# Altium project NEW2018brush_driver_PCB_Project.PrjPcb
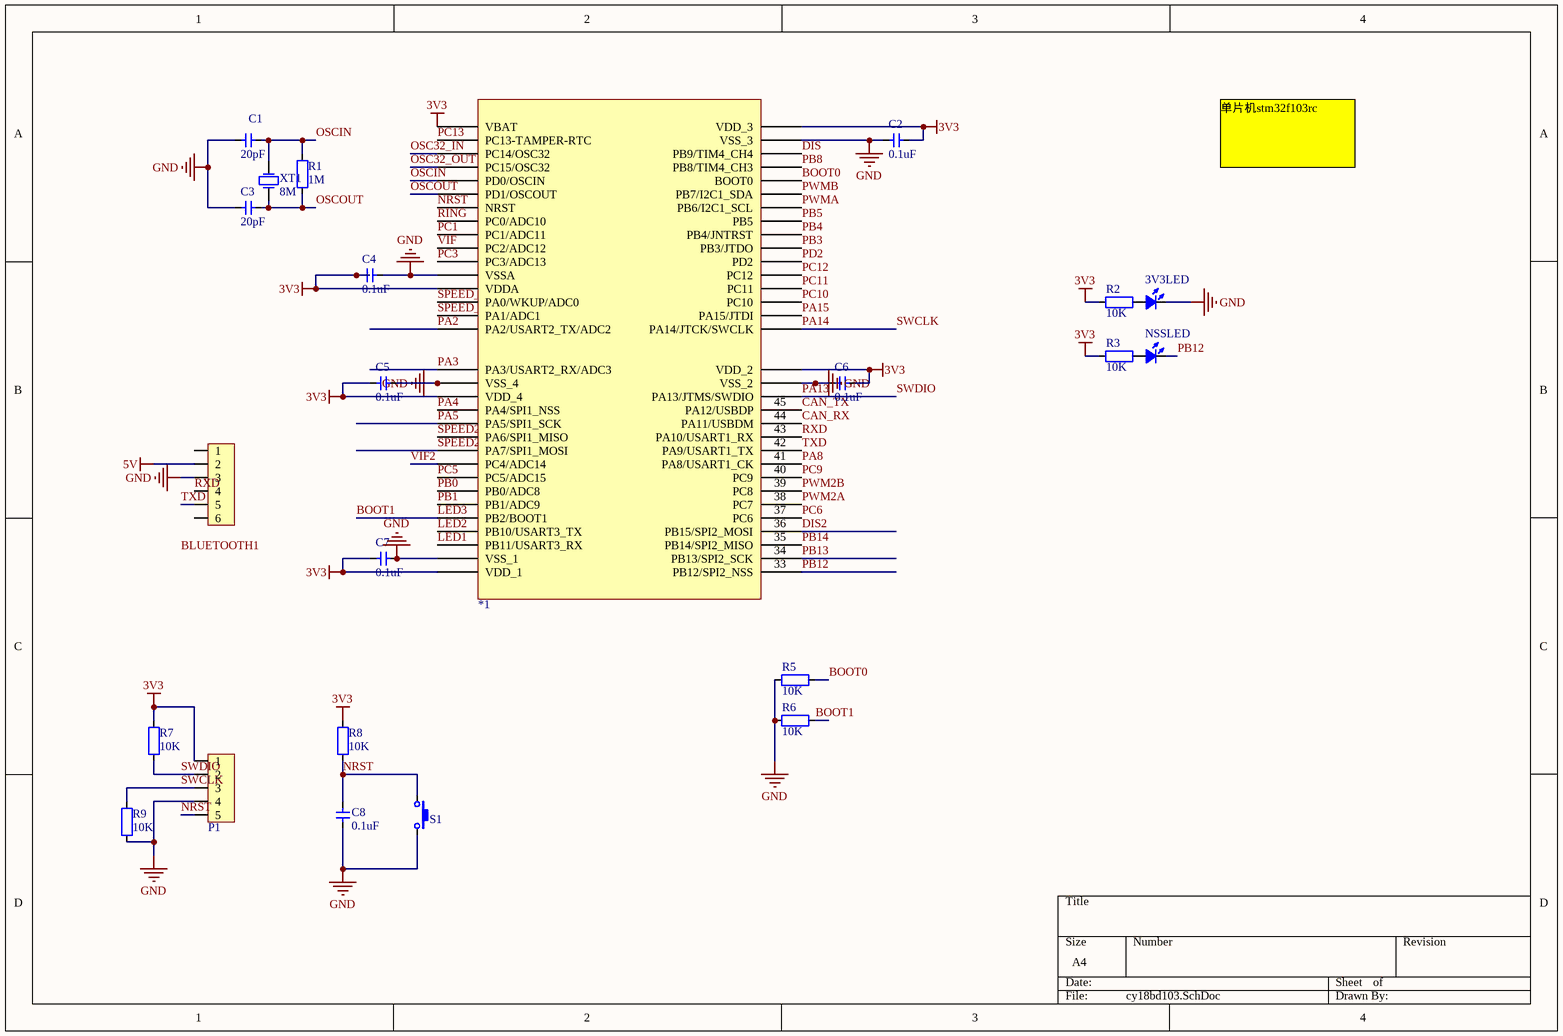
[diagram p0: cy18bd103.SchDoc]
9 sheets, 93 parts. Net scope: global (net labels, ports and power ports of the same name join across sheets).
Board file: cybd18V1.2.3F.PcbDoc
Sheets:
  cy18bd103.SchDoc
  HIP4082driver.SchDoc
  taj1050.SchDoc
  lm27313_5_12.SchDoc
  hcpl0630.SchDoc
  tps5430_VIN_5V.SchDoc
  tlv117_5_3.3.SchDoc
  74ls08.SchDoc
  电流环.SchDoc

## Sheet cy18bd103.SchDoc
size A4

### Parts
3V3LED  LED_0805blue  [LED_0805_YELLOW]  (value not drawn)
*1  STM32F103RC  [LQFP_P0.5_64]  (value not drawn)
BLUETOOTH1  HDR1x6_2.54  [HDR1X6_2.54_180]  (value not drawn)
C1  value 20pF  [CAP_0603]  (hidden comment: Cap_0603)
C2  value 0.1uF  [CAP_0603]  (hidden comment: Cap_0603)
C3  value 20pF  [CAP_0603]  (hidden comment: Cap_0603)
C4  value 0.1uF  [CAP_0603]  (hidden comment: Cap_0603)
C5  value 0.1uF  [CAP_0603]  (hidden comment: Cap_0603)
C6  value 0.1uF  [CAP_0603]  (hidden comment: Cap_0603)
C7  value 0.1uF  [CAP_0603]  (hidden comment: Cap_0603)
C8  value 0.1uF  [CAP_0603]  (hidden comment: Cap_0603)
NSSLED  LED_0805green  [LED_0805_GREEN]  (value not drawn)
P1  HDR1x5_2.54  [HDR1X5_2.54_180]  (value not drawn)
R1  value 1M  [RES_0603]  (hidden comment: Res_0603)
R2  value 10K  [RES_0603]  (hidden comment: Res_0603)
R3  value 10K  [RES_0603]  (hidden comment: Res_0603)
R5  value 10K  [RES_0603]  (hidden comment: Res_0603)
R6  value 10K  [RES_0603]  (hidden comment: Res_0603)
R7  value 10K  [RES_0603]  (hidden comment: Res_0603)
R8  value 10K  [RES_0603]  (hidden comment: Res_0603)
R9  value 10K  [RES_0603]  (hidden comment: Res_0603)
S1  ButtonTACT_3x6x2.5_180  [ButtonTACT_3x6x2.5_180]  (value not drawn)
XT1  value 8M  [XT_5032_2]  (hidden comment: XTAL_32.768kHz)

### Nets
3V3: *1.1(VBAT) *1.13(VDDA) *1.19(VDD_4) *1.32(VDD_1) *1.48(VDD_2) *1.64(VDD_3) C2.2 C4.1 C5.1 C6.2 C7.1 P1.1 R2.1 R3.1 R7.2 R8.2
5V: BLUETOOTH1.2
GND: 3V3LED.2(K) *1.12(VSSA) *1.18(VSS_4) *1.31(VSS_1) *1.47(VSS_2) *1.63(VSS_3) BLUETOOTH1.3 C1.1 C2.1 C3.1 C4.2 C5.2 C6.1 C7.2 C8.1 P1.4 R5.2 R6.2 R9.1 S1.2
BOOT0: *1.60(BOOT0) R5.1
BOOT1: *1.28(PB2/BOOT1) R6.1  [also labelled LED3]
CAN_RX: *1.44(PA11/USBDM)
CAN_TX: *1.45(PA12/USBDP)
DIS: *1.62(PB9/TIM4_CH4)
DIS2: *1.36(PB15/SPI2_MOSI)
LED1: *1.30(PB11/USART3_RX)
LED2: *1.29(PB10/USART3_TX)
NRST: *1.7(NRST) C8.2 P1.5 R8.1 S1.1
OSC32_IN: *1.3(PC14/OSC32)
OSC32_OUT: *1.4(PC15/OSC32)
OSCIN: *1.5(PD0/OSCIN) C1.2 R1.2 XT1.2(OSC2)
OSCOUT: *1.6(PD1/OSCOUT) C3.2 R1.1 XT1.1(OSC1)
PA2: *1.16(PA2/USART2_TX/ADC2)
PA3: *1.17(PA3/USART2_RX/ADC3)
PA4: *1.20(PA4/SPI1_NSS)
PA5: *1.21(PA5/SPI1_SCK)
PA8: *1.41(PA8/USART1_CK)
PA13: *1.46(PA13/JTMS/SWDIO) P1.2 R7.1  [also labelled SWDIO]
PA14: *1.49(PA14/JTCK/SWCLK) P1.3 R9.2  [also labelled SWCLK]
PA15: *1.50(PA15/JTDI)
PB0: *1.26(PB0/ADC8)
PB1: *1.27(PB1/ADC9)
PB3: *1.55(PB3/JTDO)
PB4: *1.56(PB4/JNTRST)
PB5: *1.57(PB5)
PB8: *1.61(PB8/TIM4_CH3)
PB12: *1.33(PB12/SPI2_NSS) NSSLED.2(K)
PB13: *1.34(PB13/SPI2_SCK)
PB14: *1.35(PB14/SPI2_MISO)
PC1: *1.9(PC1/ADC11)
PC3: *1.11(PC3/ADC13)
PC5: *1.25(PC5/ADC15)
PC6: *1.37(PC6)
PC9: *1.40(PC9)
PC10: *1.51(PC10)
PC11: *1.52(PC11)
PC12: *1.53(PC12)
PC13: *1.2(PC13-TAMPER-RTC)
PD2: *1.54(PD2)
PWM2A: *1.38(PC7)
PWM2B: *1.39(PC8)
PWMA: *1.58(PB6/I2C1_SCL)
PWMB: *1.59(PB7/I2C1_SDA)
RING: *1.8(PC0/ADC10)
RXD: *1.43(PA10/USART1_RX) BLUETOOTH1.4
SPEED2_A: *1.22(PA6/SPI1_MISO)
SPEED2_B: *1.23(PA7/SPI1_MOSI)
SPEED_A: *1.14(PA0/WKUP/ADC0)
SPEED_B: *1.15(PA1/ADC1)
TXD: *1.42(PA9/USART1_TX) BLUETOOTH1.5
VIF: *1.10(PC2/ADC12)
VIF2: *1.24(PC4/ADC14)
Net3V3LED_1: 3V3LED.1(A) R2.2
NetNSSLED_1: NSSLED.1(A) R3.2

Not connected (* = marked no-connect by the designer): BLUETOOTH1 1 6

### Notes on the sheet
- 单片机stm32f103rc

### Library data of the parts
3V3LED NSSLED = LED_0805: LED
*1 = STM32F103RC: MCU
BLUETOOTH1 = HDR1x6_2.54: Header
C1-C8 = Cap_0603: Capacitor
P1 = HDR1x5_2.54: Header
R1-R3 R5-R9 = Res_0603: Resistor
S1 = ButtonTACT_3x6x2.5_180: Button
XT1 = XTAL_32.768k: Crystal Oscillator

## Sheet HIP4082driver.SchDoc
size A4
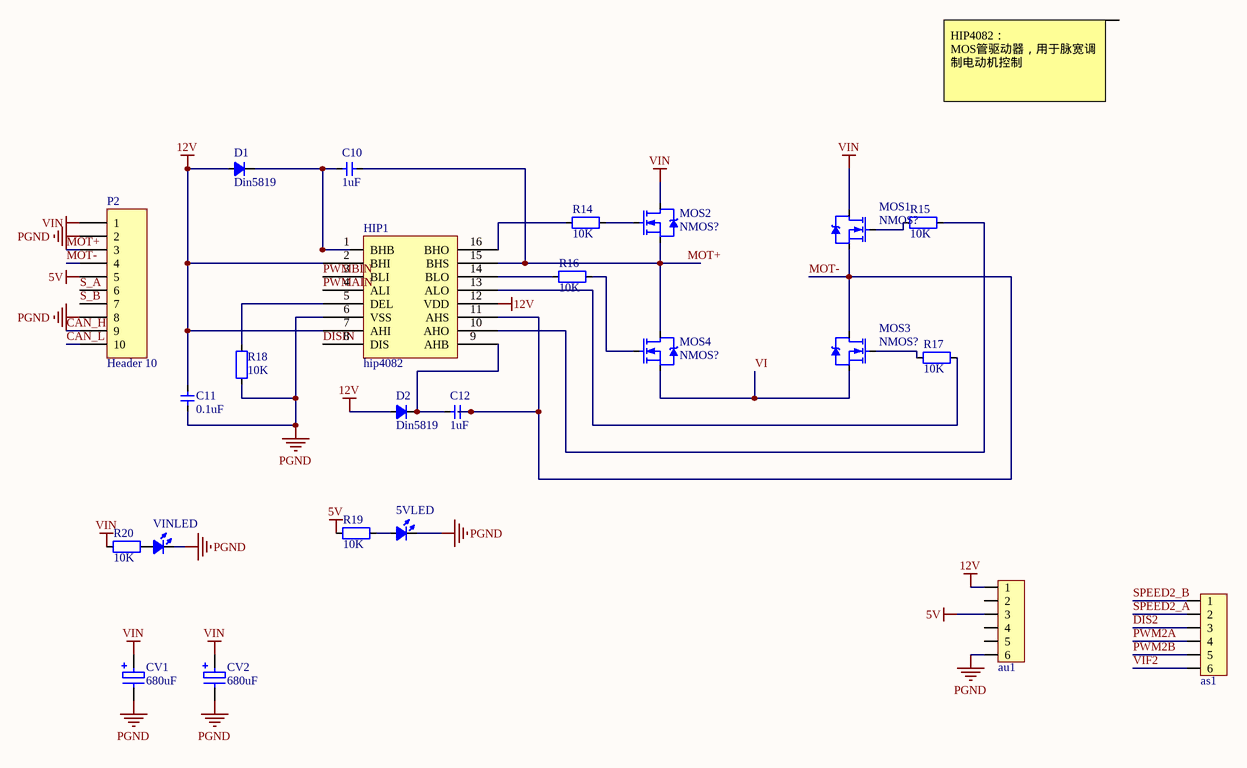
[diagram p1: HIP4082driver.SchDoc]

### Parts
5VLED  LED_0805  [LED_0805_BLUE]  (value not drawn)
as1  HDR1x6_2.54  [HDR1X6_2.54_180]  (value not drawn)
au1  HDR1x6_2.54  [HDR1X6_2.54_180]  (value not drawn)
C10  value 1uF  [CAP_0603]  (hidden comment: Cap_0603)
C11  value 0.1uF  [CAP_0603]  (hidden comment: Cap_0603)
C12  value 1uF  [CAP_0603]  (hidden comment: Cap_0603)
CV1  680uF  [CAP_ELE_680UF0.7X5MM]
CV2  680uF  [CAP_ELE_680UF0.7X5MM]
D1  Din5819  [SOD-323]
D2  Din5819  [SOD-323]
HIP1  hip4082  [SOP_E150_16]
MOS1  value NMOS?  [TO-252AA]  (hidden comment: MOSFET_N)
MOS2  value NMOS?  [TO-252AA]  (hidden comment: MOSFET_N)
MOS3  value NMOS?  [TO-252AA]  (hidden comment: MOSFET_N)
MOS4  value NMOS?  [TO-252AA]  (hidden comment: MOSFET_N)
P2  Header 10  [Green_10P]
R14  value 10K  [RES_0603]  (hidden comment: Res_0603)
R15  value 10K  [RES_0603]  (hidden comment: Res_0603)
R16  value 10K  [RES_0603]  (hidden comment: Res_0603)
R17  value 10K  [RES_0603]  (hidden comment: Res_0603)
R18  value 10K  [RES_0603]  (hidden comment: Res_0603)
R19  value 10K  [RES_0603]  (hidden comment: Res_0603)
R20  value 10K  [RES_0603]  (hidden comment: Res_0603)
VINLED  LED_0805  [LED_0805_RED]  (value not drawn)

### Nets
5V: au1.3 P2.5 R19.1
12V: au1.1 C11.2 D1.1(A) D2.1(A) HIP1.2(BHI) HIP1.7(AHI) HIP1.12(VDD)
PGND: 5VLED.2(K) au1.6 C11.1 CV1.2 CV2.2 HIP1.6(VSS) P2.2 P2.8 R18.1 VINLED.2(K)
VIN: CV1.1 CV2.1 MOS1.4(D) MOS2.4(D) P2.1 R20.1
CAN_H: P2.9
CAN_L: P2.10
DIS2: as1.3
DISIN: HIP1.8(DIS)
MOT+: C10.2 HIP1.15(BHS) MOS2.3(S) MOS4.4(D) P2.3
MOT-: C12.2 HIP1.11(AHS) MOS1.3(S) MOS3.4(D) P2.4
PWM2A: as1.4
PWM2B: as1.5
PWMAIN: HIP1.4(ALI)
PWMBIN: HIP1.3(BLI)
S_A: P2.6
S_B: P2.7
SPEED2_A: as1.2
SPEED2_B: as1.1
VI: MOS3.3(S) MOS4.3(S)
VIF2: as1.6
Net5VLED_1: 5VLED.1(A) R19.2
NetC10_1: C10.1 D1.2(K) HIP1.1(BHB)
NetC12_1: C12.1 D2.2(K) HIP1.9(AHB)
NetHIP1_5: HIP1.5(DEL) R18.2
NetHIP1_10: HIP1.10(AHO) R15.2
NetHIP1_13: HIP1.13(ALO) R17.2
NetHIP1_14: HIP1.14(BLO) R16.1
NetHIP1_16: HIP1.16(BHO) R14.1
NetMOS1_1: MOS1.1(G) R15.1
NetMOS2_1: MOS2.1(G) R14.2
NetMOS3_1: MOS3.1(G) R17.1
NetMOS4_1: MOS4.1(G) R16.2
NetR20_2: R20.2 VINLED.1(A)

Not connected (* = marked no-connect by the designer): au1 2 4 5

### Notes on the sheet
- HIP4082：
  MOS管驱动器，用于脉宽调制电动机控制

### Library data of the parts
5VLED VINLED = LED_0603: LED
as1 au1 = HDR1x6_2.54: Header
C10-C12 = Cap_0603: Capacitor
CV1 CV2 = CAP-ELE: 电解电容; Value: *μF; Published: 8-Jun-2000; LatestRevisionDate: 17-Jul-2002; LatestRevisionNote: Re-released for DXP Platform.; PackageReference: RB7.6-15; Publisher: Altium Limited; PackageDescription: Polarized Capacitor (Radial); 2 Leads
D1 D2 = Diode
MOS1-MOS4 = MOSFET_N: MOSFET
P2 = Header 10: Header, 10-Pin; LatestRevisionDate: 17-Jul-2002; LatestRevisionNote: Re-released for DXP Platform.; Publisher: Altium Limited
R14-R20 = Res_0603: Resistor

## Sheet taj1050.SchDoc
size A4
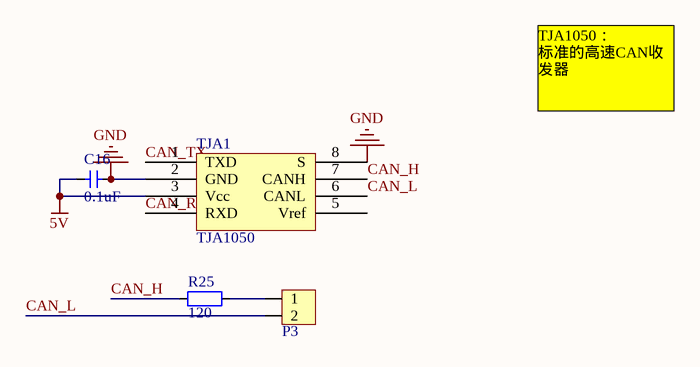
[diagram p2: taj1050.SchDoc]

### Parts
C16  value 0.1uF  [CAP_0603]  (hidden comment: Cap_0603)
P3  HDR1x2_2.54  [HDR1X2_2.54_180]  (value not drawn)
R25  value 120  [RES_0603]  (hidden comment: Res_0603)
TJA1  TJA1050  [SOP_E150_8]

### Nets
5V: C16.1 TJA1.3(Vcc)
GND: C16.2 TJA1.2(GND) TJA1.8(S)
CAN_H: R25.1 TJA1.7(CANH)
CAN_L: P3.2 TJA1.6(CANL)
CAN_RX: TJA1.4(RXD)
CAN_TX: TJA1.1(TXD)
NetP3_1: P3.1 R25.2

Not connected (* = marked no-connect by the designer): TJA1 5(Vref)

### Notes on the sheet
- TJA1050：
  标准的高速CAN收发器

### Library data of the parts
C16 = Cap_0603: Capacitor
P3 = HDR1x2_2.54: Header
R25 = Res_0603: Resistor
TJA1 = TJA1050: CAN总线收发器

## Sheet lm27313_5_12.SchDoc
size A4
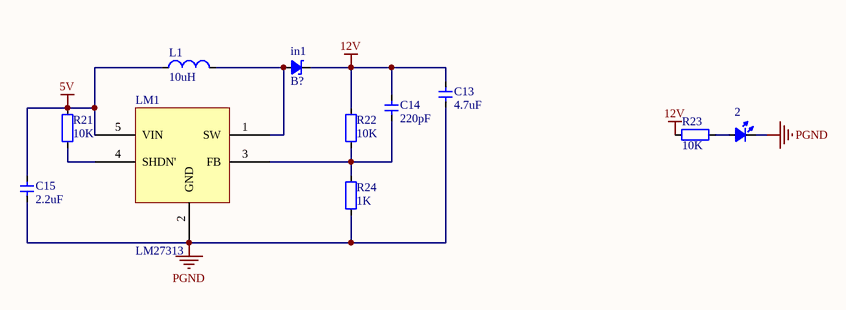
[diagram p3: lm27313_5_12.SchDoc]

### Parts
2  LED_0805  [LED_0805_GREEN]  (value not drawn)
C13  value 4.7uF  [CAP_0603]  (hidden comment: Cap_0603)
C14  value 220pF  [CAP_0603]  (hidden comment: Cap_0603)
C15  value 2.2uF  [CAP_0603]  (hidden comment: Cap_0603)
in1  value B?  [SOD-123]  (hidden comment: SchottkyDiode_SOD123)
L1  value 10uH  [indmm5x2_2_2]
LM1  LM27313  [SOT23-5]
R21  value 10K  [RES_0603]  (hidden comment: Res_0603)
R22  value 10K  [RES_0603]  (hidden comment: Res_0603)
R23  value 10K  [RES_0603]  (hidden comment: Res_0603)
R24  value 1K  [RES_0603]  (hidden comment: Res_0603)

### Nets
5V: C15.2 L1.1 LM1.5(VIN) R21.2
12V: C13.2 C14.2 in1.2(K) R22.2 R23.1
PGND: 2.2(K) C13.1 C15.1 LM1.2(GND) R24.1
Net2_1: 2.1(A) R23.2
NetC14_1: C14.1 LM1.3(FB) R22.1 R24.2
Netin1_1: in1.1(A) L1.2 LM1.1(SW)
NetLM1_4: LM1.4(SHDN') R21.1

### Library data of the parts
2 = LED_0603: LED
C13-C15 = Cap_0603: Capacitor
in1 = SchottkyDiode_SOD123: Diode
L1 = Ind_0603: Inductor
R21-R24 = Res_0603: Resistor

## Sheet hcpl0630.SchDoc
size A4
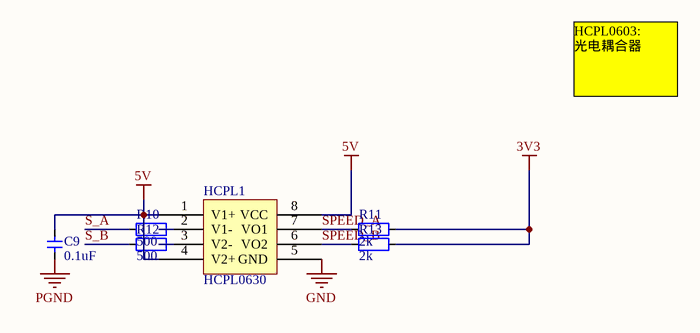
[diagram p4: hcpl0630.SchDoc]

### Parts
C9  value 0.1uF  [CAP_0603]  (hidden comment: Cap_0603)
HCPL1  HCPL0630  [SOP_E150_8]
R10  value 500  [RES_0603]  (hidden comment: Res_0603)
R11  value 2k  [RES_0603]  (hidden comment: Res_0603)
R12  value 500  [RES_0603]  (hidden comment: Res_0603)
R13  value 2k  [RES_0603]  (hidden comment: Res_0603)

### Nets
3V3: R11.1 R13.1
5V: C9.2 HCPL1.1(V1+) HCPL1.4(V2+) HCPL1.8(VCC)
GND: HCPL1.5(GND)
PGND: C9.1
S_A: R10.2
S_B: R12.2
SPEED_A: HCPL1.7(VO1) R11.2
SPEED_B: HCPL1.6(VO2) R13.2
NetHCPL1_2: HCPL1.2(V1-) R10.1
NetHCPL1_3: HCPL1.3(V2-) R12.1

### Notes on the sheet
- HCPL0603:
  光电耦合器

### Library data of the parts
C9 = Cap_0603: Capacitor
R10-R13 = Res_0603: Resistor

## Sheet tps5430_VIN_5V.SchDoc
size A4
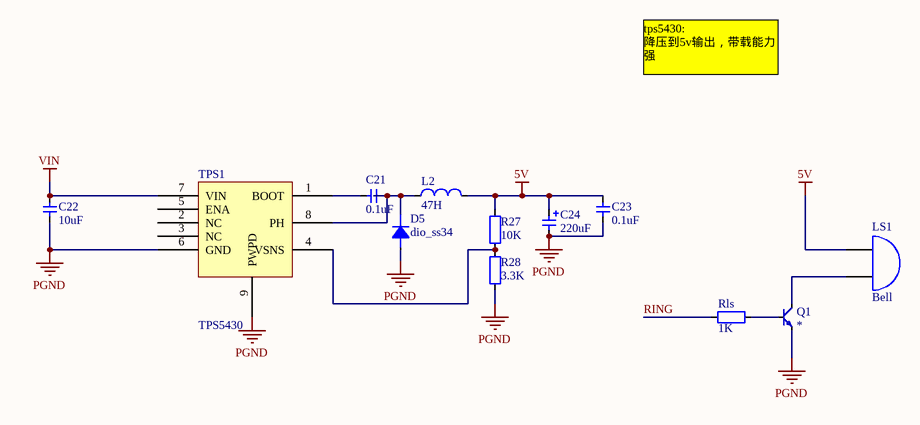
[diagram p5: tps5430_VIN_5V.SchDoc]

### Parts
(Parts that share a designator on the sheet are numbered #1, #2 ... from top to bottom, then left to right.)
C21  value 0.1uF  [CAP_0603]  (hidden comment: Cap_0603)
C22  value 10uF  [CAP_0603]  (hidden comment: Cap_0603)
C23  value 0.1uF  [CAP_0603]  (hidden comment: Cap_0603)
C24  value 220uF  [CAP-TAN-7343/CAPD]  (hidden comment: Cap_Tan_0805)
D5  dio_ss34  [dio_ss34]
L2  value 47H  [indmm5x1.2x4x5]  (hidden comment: Ind_0603)
LS1#1  Bell  [Bell-5.6-0.6-9mm]
Q1  BJT_NPN  [SOT23-3]  (value not drawn)
R27  value 10K  [RES_0603]  (hidden comment: Res_0603)
R28  value 3.3K  [RES_0603]  (hidden comment: Res_0603)
Rls  value 1K  [RES_0603]  (hidden comment: Res_0603)
TPS1  TPS5430  [SOP_E150_9]

### Nets
5V: C23.2 C24.1 L2.2 LS1#1.1(A) R27.2
PGND: C22.1 C23.1 C24.2 D5.1 Q1.2(E) R28.1 TPS1.6(GND) TPS1.9(PWPD)
VIN: C22.2 TPS1.7(VIN)
RING: Rls.1
NetC21_1: C21.1 TPS1.1(BOOT)
NetC21_2: C21.2 D5.2 L2.1 TPS1.8(PH)
NetLS1#1_2: LS1#1.2(B) Q1.3(C)
NetQ1_1: Q1.1(B) Rls.2
NetR27_1: R27.1 R28.2 TPS1.4(VSNS)

Not connected (* = marked no-connect by the designer): TPS1 2(NC) 3(NC) 5(ENA)

### Notes on the sheet
- tps5430:
  降压到5v输出，带载能力强

### Library data of the parts
C21-C23 = Cap_0603: Capacitor
C24 = Cap_Tan_0805: Capacitor
L2 = Ind_0603: Inductor
LS1#1 = Bell: Electrical Bell; Published: 24-Mar-1999; LatestRevisionDate: 17-Jul-2002; LatestRevisionNote: Re-released for DXP Platform.; PackageReference: PIN2; Publisher: Altium Limited
Q1 = BJT_NPN: Transistor; Value: *
R27 R28 Rls = Res_0603: Resistor

## Sheet tlv117_5_3.3.SchDoc
size A4
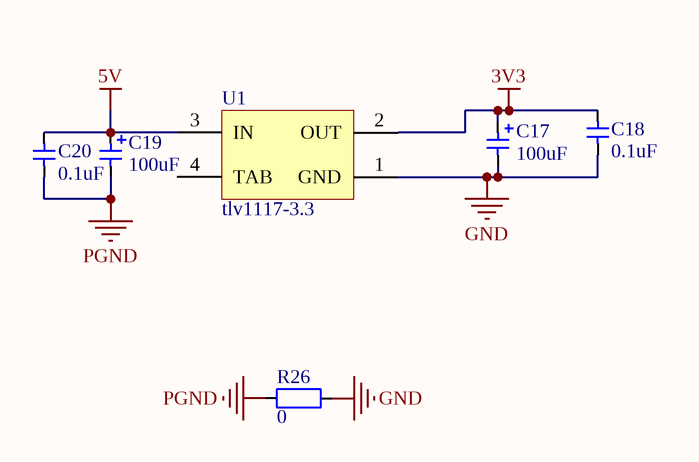
[diagram p6: tlv117_5_3.3.SchDoc]

### Parts
C17  value 100uF  [CAP-TAN-6032/CAPC]  (hidden comment: Cap_Tan_0805)
C18  value 0.1uF  [CAP_0603]  (hidden comment: Cap_0603)
C19  value 100uF  [CAP-TAN-6032/CAPC]  (hidden comment: Cap_Tan_0805)
C20  value 0.1uF  [CAP_0603]  (hidden comment: Cap_0603)
R26  value 0  [RES_0603]  (hidden comment: Res_0603)
U1  tlv1117-3.3  [SOT223-3]

### Nets
3V3: C17.1 C18.2 U1.2(OUT)
5V: C19.1 C20.2 U1.3(IN)
GND: C17.2 C18.1 R26.2 U1.1(GND)
PGND: C19.2 C20.1 R26.1

Not connected (* = marked no-connect by the designer): U1 4(TAB)

### Library data of the parts
C17 C19 = Cap_Tan_0805: Capacitor
C18 C20 = Cap_0603: Capacitor
R26 = Res_0603: Resistor
U1 = LM1117IMP-5.0: 800mA Low-Dropout Linear Regulator; Manufacturer: National Semiconductor; CompType: LDO IC; PackageTopMarking: XYTT*N06B; PowerWise: N; Published: 4-Dec-2008; DatasheetVersion: Apr-2006; PackageVersion: revB, Apr-2003; PackageReference: MP04A; Publisher: Altium Limited; PackageDescription: Molded SOT-223, 6.50 x 3.56 x 1.6mm Body, 4 Lead, 2.3mm Pitch; PartNumber: LM1117IMP-5.0; RoHS: O; PinCount: 4; DigiKeyPartNumber: LM1117IMP-5.0CT-ND; Code_JEDEC: TO-261-AA; Code_IPC: SOT223-4; ComponentLink1Description: LM1117 Datasheet; ComponentLink1URL: http://www.national.com/ds/LM/LM1117.pdf; ComponentLink2Description: LM1117 Web Page; ComponentLink2URL: http://www.national.com/pf/LM/LM1117.html; ComponentLink3Description: MP04A Package Page; ComponentLink3URL: http://www.national.com/packaging/folders/mp04a.html

## Sheet 74ls08.SchDoc
size A4
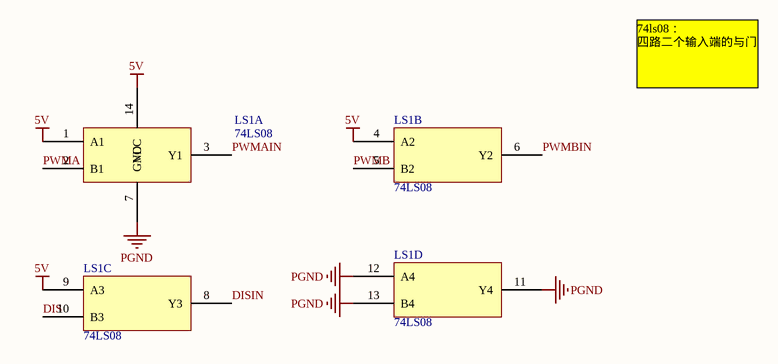
[diagram p7: 74ls08.SchDoc]

### Parts
(Parts that share a designator on the sheet are numbered #1, #2 ... from top to bottom, then left to right.)
LS1#2  74LS08  [SOP14]  (parts A,B,C,D of 4)

### Nets
5V: LS1#2.1(A1) LS1#2.4(A2) LS1#2.9(A3) LS1#2.14(VCC)
PGND: LS1#2.7(GND) LS1#2.11(Y4) LS1#2.12(A4) LS1#2.13(B4)
DIS: LS1#2.10(B3)
DISIN: LS1#2.8(Y3)
PWMA: LS1#2.2(B1)
PWMAIN: LS1#2.3(Y1)
PWMB: LS1#2.5(B2)
PWMBIN: LS1#2.6(Y2)

### Notes on the sheet
- 74ls08：
  四路二个输入端的与门

## Sheet 电流环.SchDoc
size A4
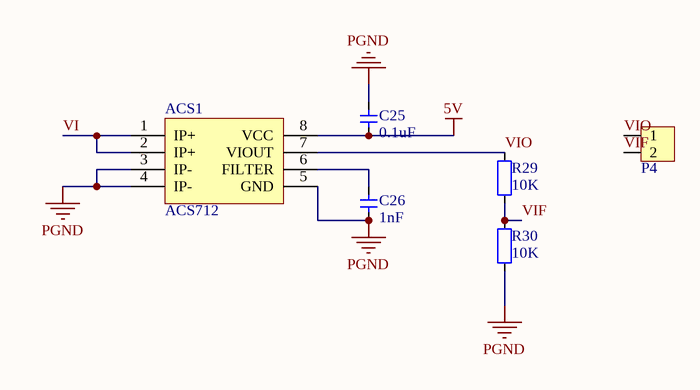
[diagram p8: 电流环.SchDoc]

### Parts
ACS1  ACS712  [SOP8ACS712]
C25  value 0.1uF  [CAP_0603]  (hidden comment: Cap_0603)
C26  value 1nF  [CAP_0603]  (hidden comment: Cap_0603)
P4  HDR1x2_2.54  [HDR1X2_2.54_180]  (value not drawn)
R29  value 10K  [RES_0603]  (hidden comment: Res_0603)
R30  value 10K  [RES_0603]  (hidden comment: Res_0603)

### Nets
5V: ACS1.8(VCC) C25.1
PGND: ACS1.3(IP-) ACS1.4(IP-) ACS1.5(GND) C25.2 C26.1 R30.2
VI: ACS1.1(IP+) ACS1.2(IP+)
VIF: P4.2 R29.2 R30.1
VIO: ACS1.7(VIOUT) P4.1 R29.1
NetACS1_6: ACS1.6(FILTER) C26.2

### Library data of the parts
ACS1 = ACS712: Sensor Current
C25 C26 = Cap_0603: Capacitor
P4 = HDR1x2_2.54: Header
R29 R30 = Res_0603: Resistor

## Nets that join several sheets
3V3: cy18bd103 (16 pins), hcpl0630 (R11.1 R13.1), tlv117_5_3.3 (C17.1 C18.2 U1.2)
5V: cy18bd103 (BLUETOOTH1.2), HIP4082driver (au1.3 P2.5 R19.1), taj1050 (C16.1 TJA1.3), lm27313_5_12 (C15.2 L1.1 LM1.5 R21.2), hcpl0630 (C9.2 HCPL1.1 HCPL1.4 HCPL1.8), tps5430_VIN_5V (5 pins), tlv117_5_3.3 (C19.1 C20.2 U1.3), 74ls08 (LS1#2.1 LS1#2.4 LS1#2.9 LS1#2.14), 电流环 (ACS1.8 C25.1)
12V: HIP4082driver (7 pins), lm27313_5_12 (5 pins)
GND: cy18bd103 (20 pins), taj1050 (C16.2 TJA1.2 TJA1.8), hcpl0630 (HCPL1.5), tlv117_5_3.3 (C17.2 C18.1 R26.2 U1.1)
PGND: HIP4082driver (10 pins), lm27313_5_12 (5 pins), hcpl0630 (C9.1), tps5430_VIN_5V (8 pins), tlv117_5_3.3 (C19.2 C20.1 R26.1), 74ls08 (LS1#2.7 LS1#2.11 LS1#2.12 LS1#2.13), 电流环 (6 pins)
VIN: HIP4082driver (6 pins), tps5430_VIN_5V (C22.2 TPS1.7)
CAN_H: HIP4082driver (P2.9), taj1050 (R25.1 TJA1.7)
CAN_L: HIP4082driver (P2.10), taj1050 (P3.2 TJA1.6)
CAN_RX: cy18bd103 (*1.44), taj1050 (TJA1.4)
CAN_TX: cy18bd103 (*1.45), taj1050 (TJA1.1)
DIS: cy18bd103 (*1.62), 74ls08 (LS1#2.10)
DIS2: cy18bd103 (*1.36), HIP4082driver (as1.3)
DISIN: HIP4082driver (HIP1.8), 74ls08 (LS1#2.8)
PWM2A: cy18bd103 (*1.38), HIP4082driver (as1.4)
PWM2B: cy18bd103 (*1.39), HIP4082driver (as1.5)
PWMA: cy18bd103 (*1.58), 74ls08 (LS1#2.2)
PWMAIN: HIP4082driver (HIP1.4), 74ls08 (LS1#2.3)
PWMB: cy18bd103 (*1.59), 74ls08 (LS1#2.5)
PWMBIN: HIP4082driver (HIP1.3), 74ls08 (LS1#2.6)
RING: cy18bd103 (*1.8), tps5430_VIN_5V (Rls.1)
S_A: HIP4082driver (P2.6), hcpl0630 (R10.2)
S_B: HIP4082driver (P2.7), hcpl0630 (R12.2)
SPEED2_A: cy18bd103 (*1.22), HIP4082driver (as1.2)
SPEED2_B: cy18bd103 (*1.23), HIP4082driver (as1.1)
SPEED_A: cy18bd103 (*1.14), hcpl0630 (HCPL1.7 R11.2)
SPEED_B: cy18bd103 (*1.15), hcpl0630 (HCPL1.6 R13.2)
VI: HIP4082driver (MOS3.3 MOS4.3), 电流环 (ACS1.1 ACS1.2)
VIF: cy18bd103 (*1.10), 电流环 (P4.2 R29.2 R30.1)
VIF2: cy18bd103 (*1.24), HIP4082driver (as1.6)